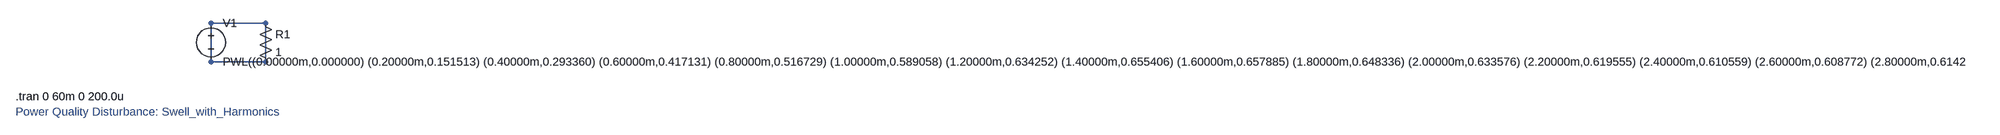
[diagram p0: schematic Swell_with_Harmonics.asc]
Swell_with_Harmonics.asc, the LTspice schematic file:
Version 4
SHEET 1 880 680
WIRE 192 128 80 128
WIRE 80 128 80 208
WIRE 192 208 80 208
WIRE 192 128 192 208
SYMBOL voltage 80 112 R0
WINDOW 123 0 0 Left 0
WINDOW 39 0 0 Left 0
SYMATTR InstName V1
SYMATTR Value PWL((0.00000m,0.000000) (0.20000m,0.151513) (0.40000m,0.293360) (0.60000m,0.417131) (0.80000m,0.516729) (1.00000m,0.589058) (1.20000m,0.634252) (1.40000m,0.655406) (1.60000m,0.657885) (1.80000m,0.648336) (2.00000m,0.633576) (2.20000m,0.619555) (2.40000m,0.610559) (2.60000m,0.608772) (2.80000m,0.614248) (3.00000m,0.625262) (3.20000m,0.638954) (3.40000m,0.652113) (3.60000m,0.661943) (3.80000m,0.666667) (4.00000m,0.665849) (4.20000m,0.660402) (4.40000m,0.652281) (4.60000m,0.643965) (4.80000m,0.637831) (5.00000m,0.635582) (5.20000m,0.637831) (5.40000m,0.643965) (5.60000m,0.652281) (5.80000m,0.660402) (6.00000m,0.665849) (6.20000m,0.666667) (6.40000m,0.661943) (6.60000m,0.652113) (6.80000m,0.638954) (7.00000m,0.625262) (7.20000m,0.614248) (7.40000m,0.608772) (7.60000m,0.610559) (7.80000m,0.619555) (8.00000m,0.633576) (8.20000m,0.648336) (8.40000m,0.657885) (8.60000m,0.655406) (8.80000m,0.634252) (9.00000m,0.589058) (9.20000m,0.516729) (9.40000m,0.417131) (9.60000m,0.293360) (9.80000m,0.151513) (10.00000m,0.000000) (10.20000m,-0.151513) (10.40000m,-0.293360) (10.60000m,-0.417131) (10.80000m,-0.516729) (11.00000m,-0.589058) (11.20000m,-0.634252) (11.40000m,-0.655406) (11.60000m,-0.657885) (11.80000m,-0.648336) (12.00000m,-0.633576) (12.20000m,-0.619555) (12.40000m,-0.610559) (12.60000m,-0.608772) (12.80000m,-0.614248) (13.00000m,-0.625262) (13.20000m,-0.638954) (13.40000m,-0.652113) (13.60000m,-0.661943) (13.80000m,-0.666667) (14.00000m,-0.665849) (14.20000m,-0.660402) (14.40000m,-0.652281) (14.60000m,-0.643965) (14.80000m,-0.637831) (15.00000m,-0.635582) (15.20000m,-0.637831) (15.40000m,-0.643965) (15.60000m,-0.652281) (15.80000m,-0.660402) (16.00000m,-0.665849) (16.20000m,-0.666667) (16.40000m,-0.661943) (16.60000m,-0.652113) (16.80000m,-0.638954) (17.00000m,-0.625262) (17.20000m,-0.614248) (17.40000m,-0.608772) (17.60000m,-0.610559) (17.80000m,-0.619555) (18.00000m,-0.633576) (18.20000m,-0.648336) (18.40000m,-0.657885) (18.60000m,-0.655406) (18.80000m,-0.634252) (19.00000m,-0.589058) (19.20000m,-0.516729) (19.40000m,-0.417131) (19.60000m,-0.293360) (19.80000m,-0.151513) (20.00000m,-0.000000) (20.20000m,0.227270) (20.40000m,0.440040) (20.60000m,0.625697) (20.80000m,0.775093) (21.00000m,0.883587) (21.20000m,0.951377) (21.40000m,0.983108) (21.60000m,0.986828) (21.80000m,0.972504) (22.00000m,0.950364) (22.20000m,0.929332) (22.40000m,0.915838) (22.60000m,0.913158) (22.80000m,0.921372) (23.00000m,0.937893) (23.20000m,0.958431) (23.40000m,0.978169) (23.60000m,0.992914) (23.80000m,1.000000) (24.00000m,0.998774) (24.20000m,0.990603) (24.40000m,0.978422) (24.60000m,0.965947) (24.80000m,0.956747) (25.00000m,0.953372) (25.20000m,0.956747) (25.40000m,0.965947) (25.60000m,0.978422) (25.80000m,0.990603) (26.00000m,0.998774) (26.20000m,1.000000) (26.40000m,0.992914) (26.60000m,0.978169) (26.80000m,0.958431) (27.00000m,0.937893) (27.20000m,0.921372) (27.40000m,0.913158) (27.60000m,0.915838) (27.80000m,0.929332) (28.00000m,0.950364) (28.20000m,0.972504) (28.40000m,0.986828) (28.60000m,0.983108) (28.80000m,0.951377) (29.00000m,0.883587) (29.20000m,0.775093) (29.40000m,0.625697) (29.60000m,0.440040) (29.80000m,0.227270) (30.00000m,0.000000) (30.20000m,-0.227270) (30.40000m,-0.440040) (30.60000m,-0.625697) (30.80000m,-0.775093) (31.00000m,-0.883587) (31.20000m,-0.951377) (31.40000m,-0.983108) (31.60000m,-0.986828) (31.80000m,-0.972504) (32.00000m,-0.950364) (32.20000m,-0.929332) (32.40000m,-0.915838) (32.60000m,-0.913158) (32.80000m,-0.921372) (33.00000m,-0.937893) (33.20000m,-0.958431) (33.40000m,-0.978169) (33.60000m,-0.992914) (33.80000m,-1.000000) (34.00000m,-0.998774) (34.20000m,-0.990603) (34.40000m,-0.978422) (34.60000m,-0.965947) (34.80000m,-0.956747) (35.00000m,-0.953372) (35.20000m,-0.956747) (35.40000m,-0.965947) (35.60000m,-0.978422) (35.80000m,-0.990603) (36.00000m,-0.998774) (36.20000m,-1.000000) (36.40000m,-0.992914) (36.60000m,-0.978169) (36.80000m,-0.958431) (37.00000m,-0.937893) (37.20000m,-0.921372) (37.40000m,-0.913158) (37.60000m,-0.915838) (37.80000m,-0.929332) (38.00000m,-0.950364) (38.20000m,-0.972504) (38.40000m,-0.986828) (38.60000m,-0.983108) (38.80000m,-0.951377) (39.00000m,-0.883587) (39.20000m,-0.775093) (39.40000m,-0.625697) (39.60000m,-0.440040) (39.80000m,-0.227270) (40.00000m,-0.000000) (40.20000m,0.151513) (40.40000m,0.293360) (40.60000m,0.417131) (40.80000m,0.516729) (41.00000m,0.589058) (41.20000m,0.634252) (41.40000m,0.655406) (41.60000m,0.657885) (41.80000m,0.648336) (42.00000m,0.633576) (42.20000m,0.619555) (42.40000m,0.610559) (42.60000m,0.608772) (42.80000m,0.614248) (43.00000m,0.625262) (43.20000m,0.638954) (43.40000m,0.652113) (43.60000m,0.661943) (43.80000m,0.666667) (44.00000m,0.665849) (44.20000m,0.660402) (44.40000m,0.652281) (44.60000m,0.643965) (44.80000m,0.637831) (45.00000m,0.635582) (45.20000m,0.637831) (45.40000m,0.643965) (45.60000m,0.652281) (45.80000m,0.660402) (46.00000m,0.665849) (46.20000m,0.666667) (46.40000m,0.661943) (46.60000m,0.652113) (46.80000m,0.638954) (47.00000m,0.625262) (47.20000m,0.614248) (47.40000m,0.608772) (47.60000m,0.610559) (47.80000m,0.619555) (48.00000m,0.633576) (48.20000m,0.648336) (48.40000m,0.657885) (48.60000m,0.655406) (48.80000m,0.634252) (49.00000m,0.589058) (49.20000m,0.516729) (49.40000m,0.417131) (49.60000m,0.293360) (49.80000m,0.151513) (50.00000m,0.000000) (50.20000m,-0.151513) (50.40000m,-0.293360) (50.60000m,-0.417131) (50.80000m,-0.516729) (51.00000m,-0.589058) (51.20000m,-0.634252) (51.40000m,-0.655406) (51.60000m,-0.657885) (51.80000m,-0.648336) (52.00000m,-0.633576) (52.20000m,-0.619555) (52.40000m,-0.610559) (52.60000m,-0.608772) (52.80000m,-0.614248) (53.00000m,-0.625262) (53.20000m,-0.638954) (53.40000m,-0.652113) (53.60000m,-0.661943) (53.80000m,-0.666667) (54.00000m,-0.665849) (54.20000m,-0.660402) (54.40000m,-0.652281) (54.60000m,-0.643965) (54.80000m,-0.637831) (55.00000m,-0.635582) (55.20000m,-0.637831) (55.40000m,-0.643965) (55.60000m,-0.652281) (55.80000m,-0.660402) (56.00000m,-0.665849) (56.20000m,-0.666667) (56.40000m,-0.661943) (56.60000m,-0.652113) (56.80000m,-0.638954) (57.00000m,-0.625262) (57.20000m,-0.614248) (57.40000m,-0.608772) (57.60000m,-0.610559) (57.80000m,-0.619555) (58.00000m,-0.633576) (58.20000m,-0.648336) (58.40000m,-0.657885) (58.60000m,-0.655406) (58.80000m,-0.634252) (59.00000m,-0.589058) (59.20000m,-0.516729) (59.40000m,-0.417131) (59.60000m,-0.293360) (59.80000m,-0.151513))
SYMBOL res 176 112 R0
SYMATTR InstName R1
SYMATTR Value 1
TEXT -320 280 Left 2 !.tran 0 60m 0 200.0u
TEXT -320 312 Left 2 ;Power Quality Disturbance: Swell_with_Harmonics

The netlist it stands for:
* Swell_with_Harmonics.asc
V1 N001 N001 PWL((0.00000m,0.000000) (0.20000m,0.151513) (0.40000m,0.293360) (0.60000m,0.417131) (0.80000m,0.516729) (1.00000m,0.589058) (1.20000m,0.634252) (1.40000m,0.655406) (1.60000m,0.657885) (1.80000m,0.648336) (2.00000m,0.633576) (2.20000m,0.619555) (2.40000m,0.610559) (2.60000m,0.608772) (2.80000m,0.614248) (3.00000m,0.625262) (3.20000m,0.638954) (3.40000m,0.652113) (3.60000m,0.661943) (3.80000m,0.666667) (4.00000m,0.665849) (4.20000m,0.660402) (4.40000m,0.652281) (4.60000m,0.643965) (4.80000m,0.637831) (5.00000m,0.635582) (5.20000m,0.637831) (5.40000m,0.643965) (5.60000m,0.652281) (5.80000m,0.660402) (6.00000m,0.665849) (6.20000m,0.666667) (6.40000m,0.661943) (6.60000m,0.652113) (6.80000m,0.638954) (7.00000m,0.625262) (7.20000m,0.614248) (7.40000m,0.608772) (7.60000m,0.610559) (7.80000m,0.619555) (8.00000m,0.633576) (8.20000m,0.648336) (8.40000m,0.657885) (8.60000m,0.655406) (8.80000m,0.634252) (9.00000m,0.589058) (9.20000m,0.516729) (9.40000m,0.417131) (9.60000m,0.293360) (9.80000m,0.151513) (10.00000m,0.000000) (10.20000m,-0.151513) (10.40000m,-0.293360) (10.60000m,-0.417131) (10.80000m,-0.516729) (11.00000m,-0.589058) (11.20000m,-0.634252) (11.40000m,-0.655406) (11.60000m,-0.657885) (11.80000m,-0.648336) (12.00000m,-0.633576) (12.20000m,-0.619555) (12.40000m,-0.610559) (12.60000m,-0.608772) (12.80000m,-0.614248) (13.00000m,-0.625262) (13.20000m,-0.638954) (13.40000m,-0.652113) (13.60000m,-0.661943) (13.80000m,-0.666667) (14.00000m,-0.665849) (14.20000m,-0.660402) (14.40000m,-0.652281) (14.60000m,-0.643965) (14.80000m,-0.637831) (15.00000m,-0.635582) (15.20000m,-0.637831) (15.40000m,-0.643965) (15.60000m,-0.652281) (15.80000m,-0.660402) (16.00000m,-0.665849) (16.20000m,-0.666667) (16.40000m,-0.661943) (16.60000m,-0.652113) (16.80000m,-0.638954) (17.00000m,-0.625262) (17.20000m,-0.614248) (17.40000m,-0.608772) (17.60000m,-0.610559) (17.80000m,-0.619555) (18.00000m,-0.633576) (18.20000m,-0.648336) (18.40000m,-0.657885) (18.60000m,-0.655406) (18.80000m,-0.634252) (19.00000m,-0.589058) (19.20000m,-0.516729) (19.40000m,-0.417131) (19.60000m,-0.293360) (19.80000m,-0.151513) (20.00000m,-0.000000) (20.20000m,0.227270) (20.40000m,0.440040) (20.60000m,0.625697) (20.80000m,0.775093) (21.00000m,0.883587) (21.20000m,0.951377) (21.40000m,0.983108) (21.60000m,0.986828) (21.80000m,0.972504) (22.00000m,0.950364) (22.20000m,0.929332) (22.40000m,0.915838) (22.60000m,0.913158) (22.80000m,0.921372) (23.00000m,0.937893) (23.20000m,0.958431) (23.40000m,0.978169) (23.60000m,0.992914) (23.80000m,1.000000) (24.00000m,0.998774) (24.20000m,0.990603) (24.40000m,0.978422) (24.60000m,0.965947) (24.80000m,0.956747) (25.00000m,0.953372) (25.20000m,0.956747) (25.40000m,0.965947) (25.60000m,0.978422) (25.80000m,0.990603) (26.00000m,0.998774) (26.20000m,1.000000) (26.40000m,0.992914) (26.60000m,0.978169) (26.80000m,0.958431) (27.00000m,0.937893) (27.20000m,0.921372) (27.40000m,0.913158) (27.60000m,0.915838) (27.80000m,0.929332) (28.00000m,0.950364) (28.20000m,0.972504) (28.40000m,0.986828) (28.60000m,0.983108) (28.80000m,0.951377) (29.00000m,0.883587) (29.20000m,0.775093) (29.40000m,0.625697) (29.60000m,0.440040) (29.80000m,0.227270) (30.00000m,0.000000) (30.20000m,-0.227270) (30.40000m,-0.440040) (30.60000m,-0.625697) (30.80000m,-0.775093) (31.00000m,-0.883587) (31.20000m,-0.951377) (31.40000m,-0.983108) (31.60000m,-0.986828) (31.80000m,-0.972504) (32.00000m,-0.950364) (32.20000m,-0.929332) (32.40000m,-0.915838) (32.60000m,-0.913158) (32.80000m,-0.921372) (33.00000m,-0.937893) (33.20000m,-0.958431) (33.40000m,-0.978169) (33.60000m,-0.992914) (33.80000m,-1.000000) (34.00000m,-0.998774) (34.20000m,-0.990603) (34.40000m,-0.978422) (34.60000m,-0.965947) (34.80000m,-0.956747) (35.00000m,-0.953372) (35.20000m,-0.956747) (35.40000m,-0.965947) (35.60000m,-0.978422) (35.80000m,-0.990603) (36.00000m,-0.998774) (36.20000m,-1.000000) (36.40000m,-0.992914) (36.60000m,-0.978169) (36.80000m,-0.958431) (37.00000m,-0.937893) (37.20000m,-0.921372) (37.40000m,-0.913158) (37.60000m,-0.915838) (37.80000m,-0.929332) (38.00000m,-0.950364) (38.20000m,-0.972504) (38.40000m,-0.986828) (38.60000m,-0.983108) (38.80000m,-0.951377) (39.00000m,-0.883587) (39.20000m,-0.775093) (39.40000m,-0.625697) (39.60000m,-0.440040) (39.80000m,-0.227270) (40.00000m,-0.000000) (40.20000m,0.151513) (40.40000m,0.293360) (40.60000m,0.417131) (40.80000m,0.516729) (41.00000m,0.589058) (41.20000m,0.634252) (41.40000m,0.655406) (41.60000m,0.657885) (41.80000m,0.648336) (42.00000m,0.633576) (42.20000m,0.619555) (42.40000m,0.610559) (42.60000m,0.608772) (42.80000m,0.614248) (43.00000m,0.625262) (43.20000m,0.638954) (43.40000m,0.652113) (43.60000m,0.661943) (43.80000m,0.666667) (44.00000m,0.665849) (44.20000m,0.660402) (44.40000m,0.652281) (44.60000m,0.643965) (44.80000m,0.637831) (45.00000m,0.635582) (45.20000m,0.637831) (45.40000m,0.643965) (45.60000m,0.652281) (45.80000m,0.660402) (46.00000m,0.665849) (46.20000m,0.666667) (46.40000m,0.661943) (46.60000m,0.652113) (46.80000m,0.638954) (47.00000m,0.625262) (47.20000m,0.614248) (47.40000m,0.608772) (47.60000m,0.610559) (47.80000m,0.619555) (48.00000m,0.633576) (48.20000m,0.648336) (48.40000m,0.657885) (48.60000m,0.655406) (48.80000m,0.634252) (49.00000m,0.589058) (49.20000m,0.516729) (49.40000m,0.417131) (49.60000m,0.293360) (49.80000m,0.151513) (50.00000m,0.000000) (50.20000m,-0.151513) (50.40000m,-0.293360) (50.60000m,-0.417131) (50.80000m,-0.516729) (51.00000m,-0.589058) (51.20000m,-0.634252) (51.40000m,-0.655406) (51.60000m,-0.657885) (51.80000m,-0.648336) (52.00000m,-0.633576) (52.20000m,-0.619555) (52.40000m,-0.610559) (52.60000m,-0.608772) (52.80000m,-0.614248) (53.00000m,-0.625262) (53.20000m,-0.638954) (53.40000m,-0.652113) (53.60000m,-0.661943) (53.80000m,-0.666667) (54.00000m,-0.665849) (54.20000m,-0.660402) (54.40000m,-0.652281) (54.60000m,-0.643965) (54.80000m,-0.637831) (55.00000m,-0.635582) (55.20000m,-0.637831) (55.40000m,-0.643965) (55.60000m,-0.652281) (55.80000m,-0.660402) (56.00000m,-0.665849) (56.20000m,-0.666667) (56.40000m,-0.661943) (56.60000m,-0.652113) (56.80000m,-0.638954) (57.00000m,-0.625262) (57.20000m,-0.614248) (57.40000m,-0.608772) (57.60000m,-0.610559) (57.80000m,-0.619555) (58.00000m,-0.633576) (58.20000m,-0.648336) (58.40000m,-0.657885) (58.60000m,-0.655406) (58.80000m,-0.634252) (59.00000m,-0.589058) (59.20000m,-0.516729) (59.40000m,-0.417131) (59.60000m,-0.293360) (59.80000m,-0.151513))
R1 N001 N001 1
.tran 0 60m 0 200.0u
* Power Quality Disturbance: Swell_with_Harmonics
.backanno
.end